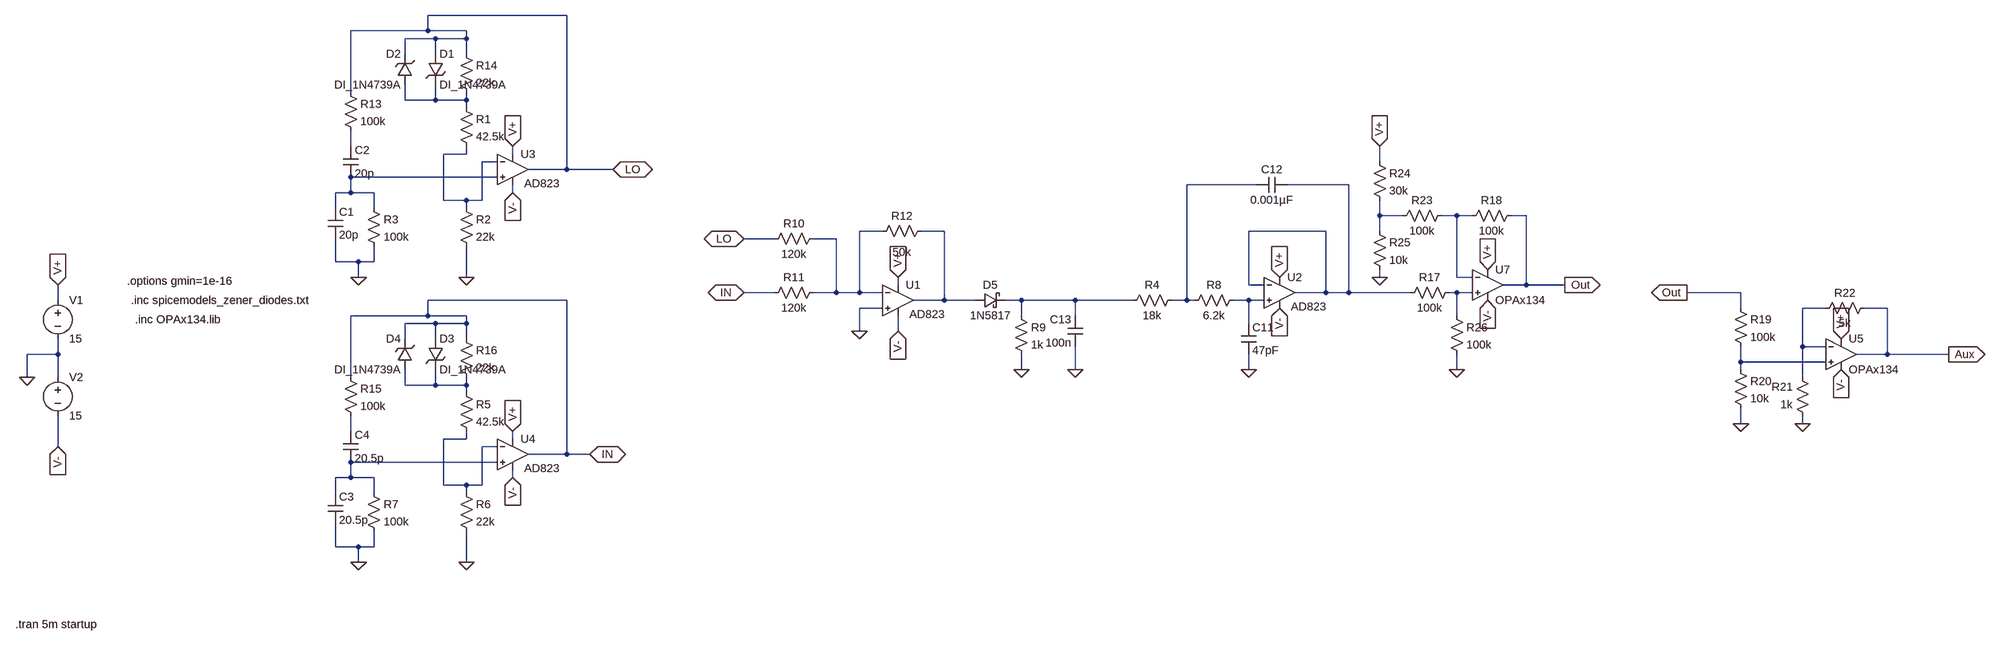
[diagram p0: schematic Draft4.asc]
Draft4.asc, the LTspice schematic file:
Version 4
SHEET 1 4248 1492
WIRE 1040 -144 752 -144
WIRE 752 -112 752 -144
WIRE 752 -112 592 -112
WIRE 832 -112 752 -112
WIRE 768 -96 704 -96
WIRE 832 -96 832 -112
WIRE 832 -96 768 -96
WIRE 704 -64 704 -96
WIRE 768 -64 768 -96
WIRE 832 -64 832 -96
WIRE 592 16 592 -112
WIRE 704 32 704 0
WIRE 768 32 768 0
WIRE 768 32 704 32
WIRE 832 32 832 16
WIRE 832 32 768 32
WIRE 832 48 832 32
WIRE 592 128 592 96
WIRE 832 144 832 128
WIRE 832 144 784 144
WIRE 928 144 928 128
WIRE 896 160 864 160
WIRE 2832 160 2832 128
WIRE 1040 176 1040 -144
WIRE 1040 176 960 176
WIRE 1136 176 1040 176
WIRE 896 192 592 192
WIRE 2576 208 2432 208
WIRE 2768 208 2640 208
WIRE 592 224 592 192
WIRE 592 224 560 224
WIRE 640 224 592 224
WIRE 928 224 928 208
WIRE 784 240 784 144
WIRE 832 240 784 240
WIRE 864 240 864 160
WIRE 864 240 832 240
WIRE 560 256 560 224
WIRE 640 256 640 224
WIRE 832 256 832 240
WIRE 2832 272 2832 240
WIRE 2880 272 2832 272
WIRE 2992 272 2960 272
WIRE 3024 272 2992 272
WIRE 3136 272 3104 272
WIRE 1792 304 1744 304
WIRE 1920 304 1872 304
WIRE 2720 304 2560 304
WIRE 2832 304 2832 272
WIRE 1568 320 1504 320
WIRE 1696 320 1648 320
WIRE 560 368 560 320
WIRE 608 368 560 368
WIRE 640 368 640 336
WIRE 640 368 608 368
WIRE 608 400 608 368
WIRE 832 400 832 336
WIRE 2832 400 2832 384
WIRE 2992 400 2992 272
WIRE 3024 400 2992 400
WIRE 1824 416 1824 400
WIRE 2560 416 2560 304
WIRE 2592 416 2560 416
WIRE 3136 416 3136 272
WIRE 3136 416 3088 416
WIRE 3216 416 3136 416
WIRE 1568 432 1504 432
WIRE 1696 432 1696 320
WIRE 1696 432 1648 432
WIRE 1744 432 1744 304
WIRE 1744 432 1696 432
WIRE 1792 432 1744 432
WIRE 2720 432 2720 304
WIRE 2720 432 2656 432
WIRE 2768 432 2768 208
WIRE 2768 432 2720 432
WIRE 2896 432 2768 432
WIRE 2992 432 2976 432
WIRE 3024 432 2992 432
WIRE 3648 432 3536 432
WIRE -16 448 -16 416
WIRE 1040 448 752 448
WIRE 1920 448 1920 304
WIRE 1920 448 1856 448
WIRE 1984 448 1920 448
WIRE 2080 448 2048 448
WIRE 2192 448 2080 448
WIRE 2320 448 2192 448
WIRE 2432 448 2432 208
WIRE 2432 448 2400 448
WIRE 2448 448 2432 448
WIRE 2560 448 2528 448
WIRE 2592 448 2560 448
WIRE 1792 464 1744 464
WIRE 3648 464 3648 432
WIRE 3824 464 3776 464
WIRE 3952 464 3904 464
WIRE 752 480 752 448
WIRE 752 480 592 480
WIRE 832 480 752 480
WIRE 2080 480 2080 448
WIRE 2192 480 2192 448
WIRE 2992 480 2992 432
WIRE 768 496 704 496
WIRE 832 496 832 480
WIRE 832 496 768 496
WIRE 2560 496 2560 448
WIRE 1744 512 1744 464
WIRE 1824 512 1824 480
WIRE 704 528 704 496
WIRE 768 528 768 496
WIRE 832 528 832 496
WIRE 3776 544 3776 464
WIRE 3824 544 3776 544
WIRE -16 560 -16 528
WIRE -16 560 -80 560
WIRE 3952 560 3952 464
WIRE 3952 560 3888 560
WIRE 4144 560 3952 560
WIRE 3648 576 3648 544
WIRE 3824 576 3648 576
WIRE 2080 592 2080 560
WIRE 2192 592 2192 544
WIRE 2560 592 2560 560
WIRE 2992 592 2992 560
WIRE 3648 592 3648 576
WIRE -80 608 -80 560
WIRE -16 608 -16 560
WIRE 592 608 592 480
WIRE 3776 608 3776 544
WIRE 704 624 704 592
WIRE 768 624 768 592
WIRE 768 624 704 624
WIRE 832 624 832 608
WIRE 832 624 768 624
WIRE 832 640 832 624
WIRE 3648 704 3648 672
WIRE 3776 704 3776 688
WIRE 592 720 592 688
WIRE 832 736 832 720
WIRE 832 736 784 736
WIRE 928 736 928 720
WIRE -16 752 -16 688
WIRE 896 752 864 752
WIRE 1040 768 1040 448
WIRE 1040 768 960 768
WIRE 1088 768 1040 768
WIRE 896 784 592 784
WIRE 592 816 592 784
WIRE 592 816 560 816
WIRE 640 816 592 816
WIRE 928 816 928 800
WIRE 784 832 784 736
WIRE 832 832 784 832
WIRE 864 832 864 752
WIRE 864 832 832 832
WIRE 560 848 560 816
WIRE 640 848 640 816
WIRE 832 848 832 832
WIRE 560 960 560 912
WIRE 608 960 560 960
WIRE 640 960 640 928
WIRE 640 960 608 960
WIRE 608 992 608 960
WIRE 832 992 832 928
FLAG -16 416 V+
IOPIN -16 416 In
FLAG 1504 320 LO
IOPIN 1504 320 BiDir
FLAG 1088 768 IN
IOPIN 1088 768 BiDir
FLAG 1504 432 IN
IOPIN 1504 432 BiDir
FLAG 3216 416 Out
IOPIN 3216 416 Out
FLAG -80 608 0
FLAG -16 752 V-
IOPIN -16 752 In
FLAG 1824 512 V-
IOPIN 1824 512 In
FLAG 1824 400 V+
IOPIN 1824 400 In
FLAG 1744 512 0
FLAG 2560 592 0
FLAG 2624 400 V+
IOPIN 2624 400 In
FLAG 2624 464 V-
IOPIN 2624 464 In
FLAG 2080 592 0
FLAG 2192 592 0
FLAG 928 128 V+
IOPIN 928 128 In
FLAG 928 224 V-
IOPIN 928 224 In
FLAG 1136 176 LO
IOPIN 1136 176 BiDir
FLAG 832 400 0
FLAG 608 400 0
FLAG 928 720 V+
IOPIN 928 720 In
FLAG 928 816 V-
IOPIN 928 816 In
FLAG 832 992 0
FLAG 608 992 0
FLAG 3536 432 Out
IOPIN 3536 432 Out
FLAG 4144 560 Aux
IOPIN 4144 560 Out
FLAG 3648 704 0
FLAG 3776 704 0
FLAG 3856 592 V-
IOPIN 3856 592 In
FLAG 3856 528 V+
IOPIN 3856 528 In
FLAG 3056 448 V-
IOPIN 3056 448 In
FLAG 3056 384 V+
IOPIN 3056 384 In
FLAG 2832 400 0
FLAG 2832 128 V+
IOPIN 2832 128 In
FLAG 2992 592 0
SYMBOL voltage -16 432 R0
WINDOW 123 0 0 Left 0
WINDOW 39 0 0 Left 0
SYMATTR InstName V1
SYMATTR Value 15
SYMBOL voltage -16 592 R0
WINDOW 123 0 0 Left 0
WINDOW 39 0 0 Left 0
SYMATTR InstName V2
SYMATTR Value 15
SYMBOL schottky 1984 464 R270
WINDOW 0 32 32 VTop 2
WINDOW 3 0 32 VBottom 2
SYMATTR InstName D5
SYMATTR Value 1N5817
SYMATTR Description Diode
SYMATTR Type diode
SYMBOL OpAmps\\AD823 1824 384 R0
WINDOW 3 24 93 Left 2
SYMATTR InstName U1
SYMBOL res 1664 304 R90
WINDOW 0 0 56 VBottom 2
WINDOW 3 32 56 VTop 2
SYMATTR InstName R10
SYMATTR Value 120k
SYMBOL res 1664 416 R90
WINDOW 0 0 56 VBottom 2
WINDOW 3 32 56 VTop 2
SYMATTR InstName R11
SYMATTR Value 120k
SYMBOL res 1888 288 R90
WINDOW 0 0 56 VBottom 2
WINDOW 3 44 56 VTop 2
SYMATTR InstName R12
SYMATTR Value 50k
SYMBOL res 2416 432 R90
WINDOW 0 0 56 VBottom 2
WINDOW 3 32 56 VTop 2
SYMATTR InstName R4
SYMATTR Value 18k
SYMBOL res 2544 432 R90
WINDOW 0 0 56 VBottom 2
WINDOW 3 32 56 VTop 2
SYMATTR InstName R8
SYMATTR Value 6.2k
SYMBOL OpAmps\\AD823 2624 368 R0
WINDOW 3 24 93 Left 2
SYMATTR InstName U2
SYMBOL cap 2544 496 R0
SYMATTR InstName C11
SYMATTR Value 47pF
SYMBOL res 2064 464 R0
SYMATTR InstName R9
SYMATTR Value 1k
SYMBOL cap 2640 192 R90
WINDOW 0 0 32 VBottom 2
WINDOW 3 32 32 VTop 2
SYMATTR InstName C12
SYMATTR Value 0.001µF
SYMBOL cap 2208 544 R180
WINDOW 0 24 56 Left 2
WINDOW 3 24 8 Left 2
SYMATTR InstName C13
SYMATTR Value 100n
SYMBOL res 816 32 R0
SYMATTR InstName R1
SYMATTR Value 42.5k
SYMBOL res 816 240 R0
SYMATTR InstName R2
SYMATTR Value 22k
SYMBOL res 624 240 R0
SYMATTR InstName R3
SYMATTR Value 100k
SYMBOL cap 544 256 R0
SYMATTR InstName C1
SYMATTR Value 20p
SYMBOL cap 576 128 R0
SYMATTR InstName C2
SYMATTR Value 20p
SYMBOL res 576 0 R0
SYMATTR InstName R13
SYMATTR Value 100k
SYMBOL OpAmps\\AD823 928 112 R0
WINDOW 3 24 93 Left 2
SYMATTR InstName U3
SYMBOL res 816 -80 R0
SYMATTR InstName R14
SYMATTR Value 22k
SYMBOL zener 752 -64 R0
SYMATTR InstName D1
SYMATTR Value DI_1N4739A
SYMATTR Prefix X
SYMBOL zener 720 0 R180
WINDOW 0 24 64 Left 2
WINDOW 3 24 0 Left 2
SYMATTR InstName D2
SYMATTR Value DI_1N4739A
SYMATTR Prefix X
SYMBOL res 816 624 R0
SYMATTR InstName R5
SYMATTR Value 42.5k
SYMBOL res 816 832 R0
SYMATTR InstName R6
SYMATTR Value 22k
SYMBOL res 624 832 R0
SYMATTR InstName R7
SYMATTR Value 100k
SYMBOL cap 544 848 R0
SYMATTR InstName C3
SYMATTR Value 20.5p
SYMBOL cap 576 720 R0
SYMATTR InstName C4
SYMATTR Value 20.5p
SYMBOL res 576 592 R0
SYMATTR InstName R15
SYMATTR Value 100k
SYMBOL OpAmps\\AD823 928 704 R0
WINDOW 3 24 93 Left 2
SYMATTR InstName U4
SYMBOL res 816 512 R0
SYMATTR InstName R16
SYMATTR Value 22k
SYMBOL zener 752 528 R0
SYMATTR InstName D3
SYMATTR Value DI_1N4739A
SYMATTR Prefix X
SYMBOL zener 720 592 R180
WINDOW 0 24 64 Left 2
WINDOW 3 24 0 Left 2
SYMATTR InstName D4
SYMATTR Value DI_1N4739A
SYMATTR Prefix X
SYMBOL res 3632 448 R0
SYMATTR InstName R19
SYMATTR Value 100k
SYMBOL res 3632 576 R0
SYMATTR InstName R20
SYMATTR Value 10k
SYMBOL res 3792 704 R180
WINDOW 0 36 76 Left 2
WINDOW 3 36 40 Left 2
SYMATTR InstName R21
SYMATTR Value 1k
SYMBOL res 3920 448 R90
WINDOW 0 0 56 VBottom 2
WINDOW 3 32 56 VTop 2
SYMATTR InstName R22
SYMATTR Value 5k
SYMBOL res 2992 416 R90
WINDOW 0 0 56 VBottom 2
WINDOW 3 32 56 VTop 2
SYMATTR InstName R17
SYMATTR Value 100k
SYMBOL res 3120 256 R90
WINDOW 0 0 56 VBottom 2
WINDOW 3 32 56 VTop 2
SYMATTR InstName R18
SYMATTR Value 100k
SYMBOL res 2976 256 R90
WINDOW 0 0 56 VBottom 2
WINDOW 3 32 56 VTop 2
SYMATTR InstName R23
SYMATTR Value 100k
SYMBOL res 2816 144 R0
SYMATTR InstName R24
SYMATTR Value 30k
SYMBOL res 2816 288 R0
SYMATTR InstName R25
SYMATTR Value 10k
SYMBOL res 2976 464 R0
SYMATTR InstName R26
SYMATTR Value 100k
SYMBOL OpAmps\\opamp2 3056 352 R0
SYMATTR InstName U7
SYMATTR Value OPAx134
SYMBOL OpAmps\\opamp2 3856 496 R0
SYMATTR InstName U5
SYMATTR Value OPAx134
TEXT 128 408 Left 2 !.options gmin=1e-16
TEXT -104 1128 Left 2 !.tran 5m startup
TEXT 136 448 Left 2 !.inc spicemodels_zener_diodes.txt
TEXT 144 488 Left 2 !.inc OPAx134.lib

The netlist it stands for:
* Draft4.asc
V1 V+ 0 15
V2 0 V- 15
D5 N010 N012 1N5817
XU1 0 N009 V+ V- N010 AD823  ; pins In+ In- V+ V- OUT
R10 N009 LO 120k
R11 N009 IN 120k
R12 N010 N009 50k
R4 N005 N012 18k
R8 N013 N005 6.2k
XU2 N013 N006 V+ V- N006 AD823  ; pins In+ In- V+ V- OUT
C11 N013 0 47pF
R9 N012 0 1k
C12 N006 N005 0.001µF
C13 0 N012 100n
R1 N001 N003 42.5k
R2 N003 0 22k
R3 N004 0 100k
C1 N004 0 20p
C2 N002 N004 20p
R13 LO N002 100k
XU3 N004 N003 V+ V- LO AD823  ; pins In+ In- V+ V- OUT
R14 LO N001 22k
XD1 LO N001 DI_1N4739A  ; pins + -
XD2 N001 LO DI_1N4739A  ; pins + -
R5 N016 N018 42.5k
R6 N018 0 22k
R7 N019 0 100k
C3 N019 0 20.5p
C4 N017 N019 20.5p
R15 IN N017 100k
XU4 N019 N018 V+ V- IN AD823  ; pins In+ In- V+ V- OUT
R16 IN N016 22k
XD3 IN N016 DI_1N4739A  ; pins + -
XD4 N016 IN DI_1N4739A  ; pins + -
R19 Out N015 100k
R20 N015 0 10k
R21 0 N014 1k
R22 Aux N014 5k
R17 N011 N006 100k
R18 Out N008 100k
R23 N008 N007 100k
R24 V+ N007 30k
R25 N007 0 10k
R26 N011 0 100k
XU7 N011 N008 V+ V- Out OPAx134  ; pins In+ In- V+ V- OUT
XU5 N015 N014 V+ V- Aux OPAx134  ; pins In+ In- V+ V- OUT
.model D D
.lib standard.dio
.options gmin=1e-16
.tran 5m startup
.inc spicemodels_zener_diodes.txt
.inc OPAx134.lib
.lib ADI.lib
.backanno
.end